# EAGLE design Planta_3 sobreamortiguada (EAGLE 7.6.0)
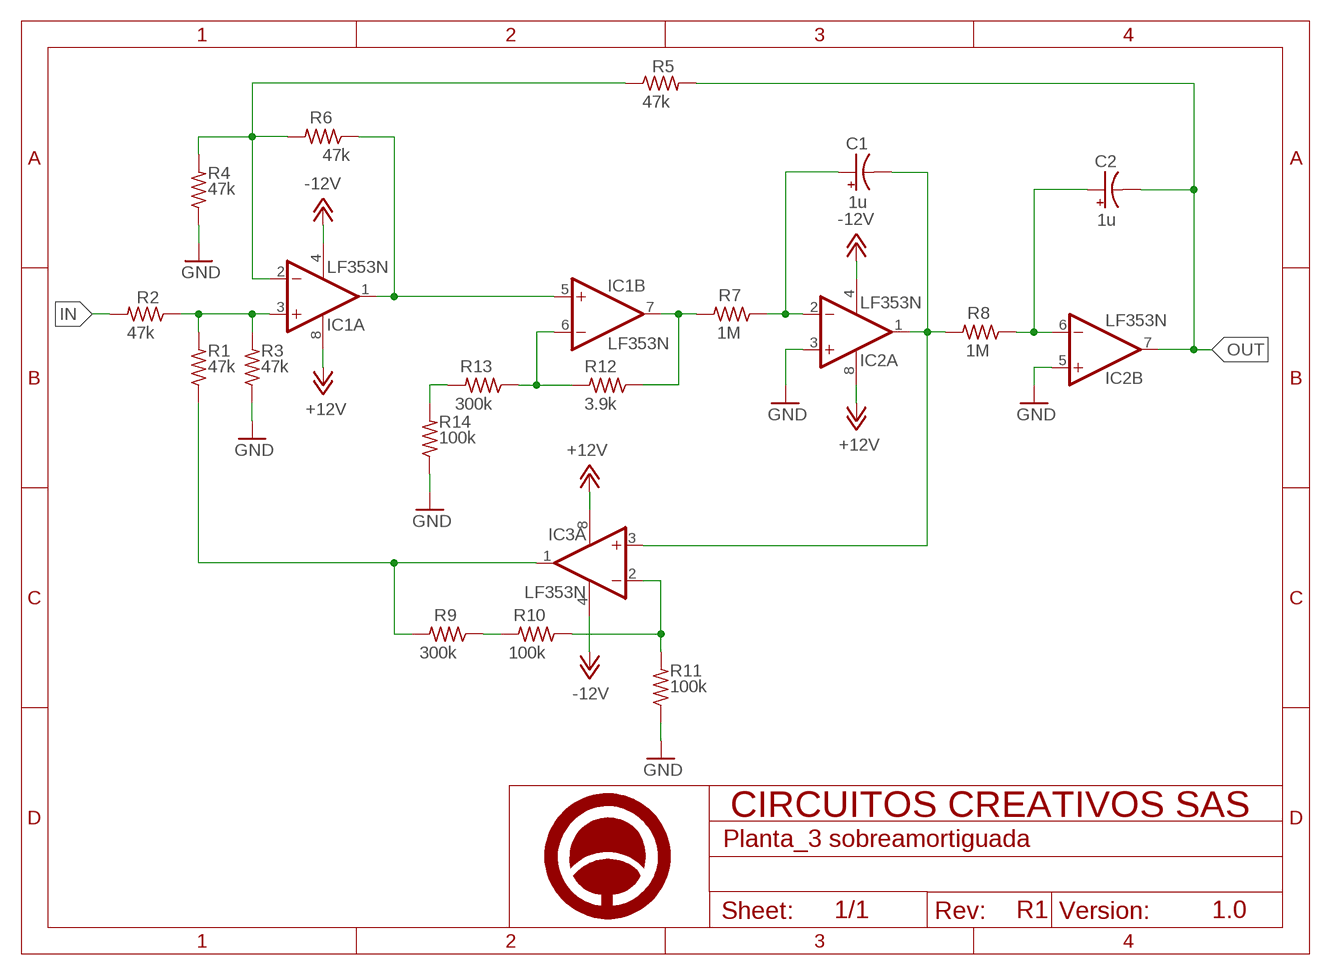
[diagram p0: schematic, sheet 1]

## Parts
C1  1u  CPOL-USE2-5  [E2-5]
C2  1u  CPOL-USE2-5  [E2-5]
F1  A5_HORIZONTAL  [LOGO]
IC1  LF353N  [DIL08]
IC2  LF353N  [DIL08]
IC3  LF353N  [DIL08]
R1  47k  R-US_0204/7  [0204/7]
R2  47k  R-US_0204/7  [0204/7]
R3  47k  R-US_0204/7  [0204/7]
R4  47k  R-US_0204/7  [0204/7]
R5  47k  R-US_0204/7  [0204/7]
R6  47k  R-US_0204/7  [0204/7]
R7  1M  R-US_0204/7  [0204/7]
R8  1M  R-US_0204/7  [0204/7]
R9  300k  R-US_0204/7  [0204/7]
R10  100k  R-US_0204/7  [0204/7]
R11  100k  R-US_0204/7  [0204/7]
R12  3.9k  R-US_0204/7  [0204/7]
R13  300k  R-US_0204/7  [0204/7]
R14  100k  R-US_0204/7  [0204/7]

## Nets
+12V: IC1.8(P:V+) IC2.8(P:V+) IC3.8(P:V+)
-12V: IC1.4(P:V-) IC2.4(P:V-) IC3.4(P:V-)
GND: IC2.3(A:+IN) IC2.5(B:+IN) R3.1 R4.1 R11.1 R14.1
IN: R2.2
N$3: IC1.2(A:-IN) R4.2 R5.1 R6.2
N$4: IC1.1(A:OUT) IC1.5(B:+IN) R6.1
N$5: C1.+ IC2.2(A:-IN) R7.1
N$6: C1.- IC2.1(A:OUT) IC3.3(A:+IN) R8.2
N$7: C2.+ IC2.6(B:-IN) R8.1
N$8: R9.1 R10.2
N$10: IC3.1(A:OUT) R1.1 R9.2
N$11: IC3.2(A:-IN) R10.1 R11.2
N$13: IC1.6(B:-IN) R12.2 R13.1
N$14: IC1.7(B:OUT) R7.2 R12.1
N$15: R13.2 R14.2
N$16: IC1.3(A:+IN) R1.2 R2.1 R3.2
OUT: C2.- IC2.7(B:OUT) R5.2
Unconnected: IC3.5(B:+IN) IC3.6(B:-IN) IC3.7(B:OUT)

## Notes on the sheet
- R1 | 1.0

## Library data of the parts
C1 C2 = rcl:CPOL-US: POLARIZED CAPACITOR, American symbol
F1 = Circuitos-Creativos-Estilos:A5_HORIZONTAL
IC1-IC3 = linear:LF353: OP AMP
R1-R14 = rcl:R-US_: RESISTOR, American symbol

## Board
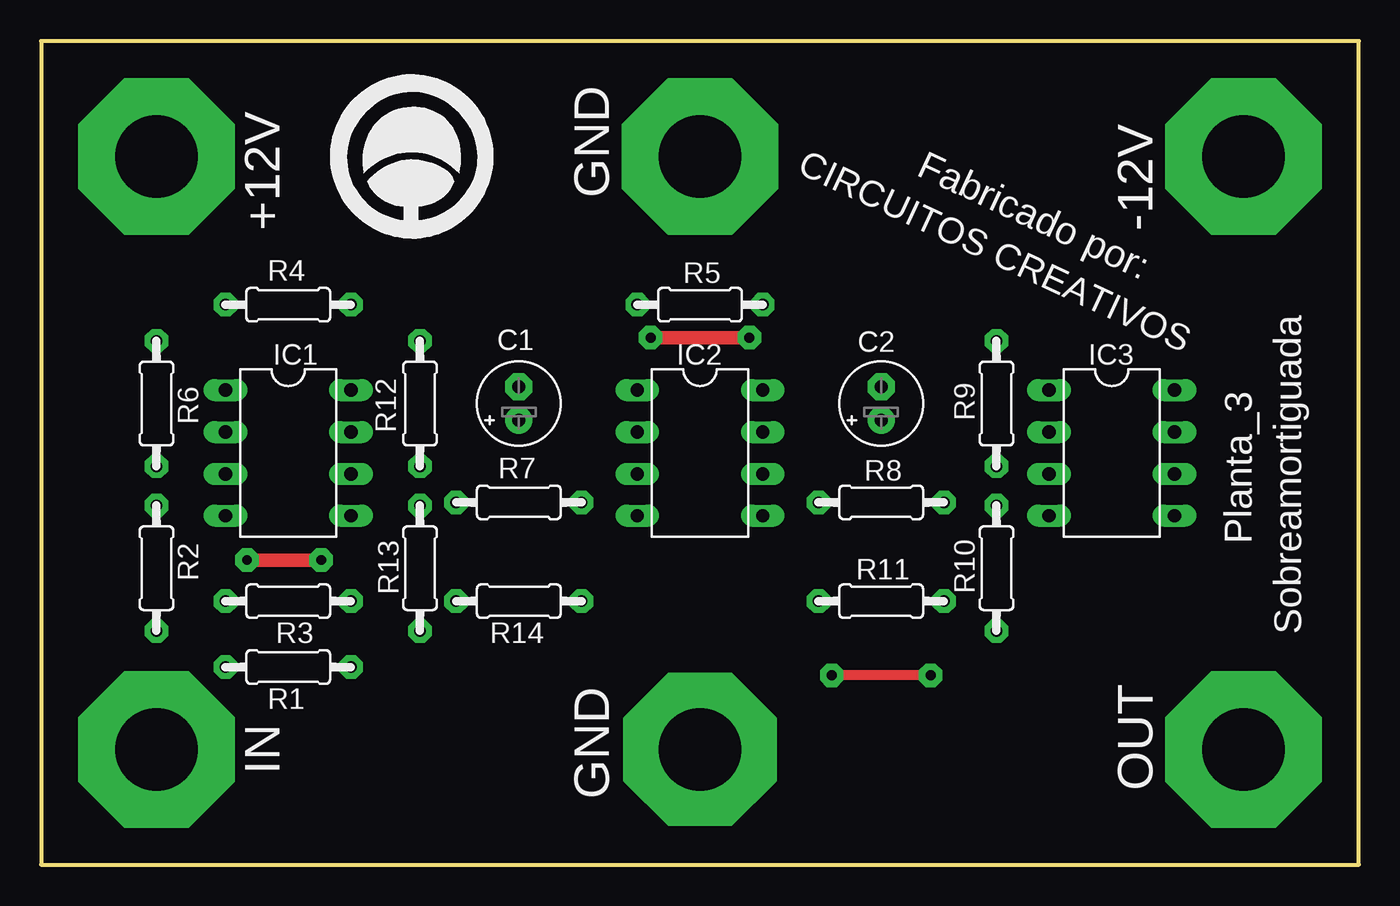
[diagram p1: board, top side]
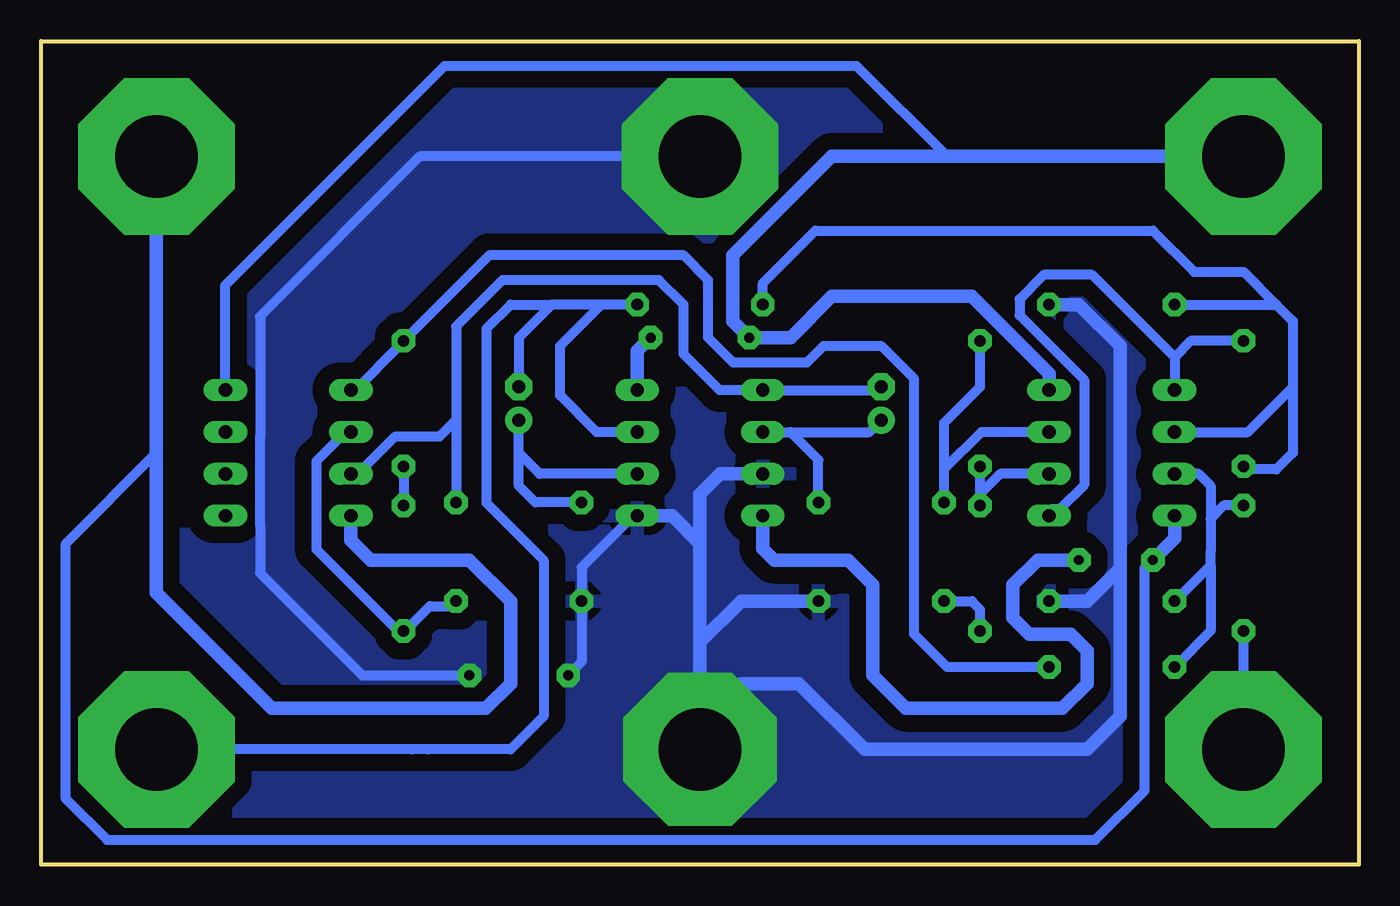
[diagram p2: board, bottom side, seen from below]

Size 80 x 50 mm. Coordinates in mm from the lower left corner, seen from the top.
Outline: 0,0 80,0 80,50 0,50 0,0
Copper layers (1*16): Top 0.035mm / dielectric 1.5mm / Bottom 0.035mm
Design rules "DRC_Serigrafia_1capa": minimum track width 0.6mm, minimum drill 0.6mm, track to track 15mil, track to pad 15mil, pad to pad 15mil, via to via 15mil, smd to smd 10mil, copper to edge 1mm, drill to drill 15mil, minimum pad ring 10mil, minimum via ring 8mil, stop-mask expansion 4mil, vias tented up to drill 0mil, thermal gap 20mil

### Footprints (pad centres in the part's own frame; a part is rotated, then mirrored left to right if it is on the bottom)
E2-5 = drill 0.8 pad 1.65: + -1.016,0 | drill 0.8 pad 1.65 octagon: - 1.016,0
DIL08 = drill 0.813 pad 1.27 long: 1 -3.81,-3.81; 2 -1.27,-3.81; 3 1.27,-3.81; 4 3.81,-3.81; 5 3.81,3.81; 6 1.27,3.81; 7 -1.27,3.81; 8 -3.81,3.81
0204/7 = drill 0.7 pad 1.422 octagon: 1 -3.81,0; 2 3.81,0

### Placement (x,y rotation side)
C1  29,28 90 top
C2  51,28 90 top
F1  22.5,43 0 top
IC1  15,25 270 top
IC2  40,25 270 top
IC3  65,25 270 top
R1  15,12 180 top
R2  7,18 270 top
R3  15,16 180 top
R4  15,34 180 top
R5  40,34 0 top
R6  7,28 270 top
R7  29,22 180 top
R8  51,22 0 top
R9  58,28 90 top
R10  58,18 90 top
R11  51,16 0 top
R12  23,28 270 top
R13  23,18 270 top
R14  29,16 180 top

### Tracks (layer width: path | path; a pad name or v marks a point on that pad's centre or on a via)
+12V  (via drill 0.6 pad 1.42, 5 pad 9.5)
  Top 0.813: v43,32 v37,32
  Bottom 0.61: IC3.8 68.81,35.19 55.5,48.5 30.5,48.5 25,43 24.5,43
  Bottom 0.813: IC1.8 18.81,29.81 23.5,34.5 32,34.5 34.5,32 v37,32 38,33 38,37 32,43 24.5,43 v7,43 | IC2.8 43.81,31.19 v43,32
-12V  (via drill 0.6 pad 1.42, 5 pad 9.5)
  Top 0.813: v17,18.5 v12.5,18.5
  Bottom 0.61: v12.5,18.5 13,18 13,4.5 16,1.5 76,1.5 78.5,4 78.5,19.5 73,25
  Bottom 0.813: IC3.4 61.19,19.69 60,18.5 54,18.5 51.5,16 51.5,11 53,9.5 66,9.5 73,16.5 73,25 v73,43 | IC2.4 36.19,19.19 35.5,18.5 31,18.5 29.5,17 29.5,11.5 27.5,9.5 18,9.5 16.5,11 16.5,13 17.5,14 20,14 21,15 21,17 19.5,18.5 v17,18.5 | v12.5,18.5 11.19,19.81 IC1.4
GND  (via drill 0.6 pad 1.42, 5 pad 9.3, 5 pad 9.5)
  Top 0.61: v54,11.5 v48,11.5
  Bottom 0.6: 47.09,18.15 44.15,21.09 IC2.5 | 66.71,20.6 66.71,26
  Bottom 0.61: v40,43 57,43 66.71,33.29 66.71,26 | 66.71,20.6 66.71,17.71 60.5,11.5 v54,11.5 | v48,11.5 47.19,12.31 R11.1 47.19,18.05 47.09,18.15
  Bottom 0.813: R14.1 37.5,16 40,13.5 | 40,13.5 40,8.5 | 40,8.5 v40,7 | IC2.3 38.77,23.73 40,22.5 40,19.5 | 40,19.5 40,13.5 | IC2.5 41.69,21.19 40,19.5 | 14.5,18 14.5,9 16.5,7 30,7 34,11 37.5,11 40,8.5 | R4.1 17,34 14.5,31.5 14.5,18 | 14.5,18 16.5,16 R3.1
  pour Bottom (isolate 1.016): -1,-1 81,-1 81,51 -1,51
IN  (via drill 5 pad 9.5)
  Bottom 0.61: v7,7 R2.2
N$3
  Bottom 0.61: R4.2 5,34 | 5,34 4,33 4,29 | 4,29 4,25 5,24 6.81,24 R6.2 | IC1.2 6.73,26.27 4,29 | R5.1 36.19,35.31 33,38.5 12.5,38.5 10,36 7,36 5,34
N$4
  Bottom 0.6: 11.19,30.81 16.19,35.81 19.13,35.81 20.6,34.34 20.6,33.35 16.68,29.43 16.68,23.05 18.15,21.58 18.64,21.58 IC1.5
  Bottom 0.61: R6.1 10.19,31.81 11.19,30.81 IC1.1
N$5
  Bottom 0.61: IC2.2 34.5,26.27 | 34.5,26.27 29.71,26.27 C1.+ | R7.1 32.81,24.58 34.5,26.27
N$6
  Bottom 0.61: C1.- 29.21,28.81 IC2.1 38.81,28.81 41,31 41,34 42.5,35.5 52,35.5 54.81,32.69 54.81,27 | 54.81,27 R8.2 | IC3.3 60.77,23.73 58.5,26 55.81,26 54.81,27
N$7
  Bottom 0.61: IC2.6 49.73,23.73 51,25 | 51,25 C2.+ | R8.1 50,22 51,23 51,25
N$8
  Bottom 0.61: R9.1 R10.2
N$10
  Bottom 0.6: IC3.1 60.82,28.94 58.37,31.39 R9.2
  Bottom 0.61: R9.2 52.81,37 41,37 39.5,35.5 39.5,32 38,30.5 33.5,30.5 32.5,31.5 29,31.5 27,29.5 27,14 25,12 R1.1
N$11
  Bottom 0.6: IC3.2 61.31,26 61.8,26 63.27,24.52 63.27,19.13 58.37,14.22 R10.1 57.88,14.22 56.41,15.7 54.94,15.7 R11.2
N$13
  Bottom 0.61: R12.2 23,22.5 | 23,22.5 R13.1 | IC1.6 21.77,23.73 23,22.5
N$14
  Bottom 0.61: R12.1 23,29 25.19,26.81 25.19,24 | 25.19,24 R7.2 | IC1.7 22.92,26.27 25.19,24
N$15
  Bottom 0.61: R14.2 23.5,16 23,15.5 R13.2
N$16
  Bottom 0.61: IC1.3 9.73,23.73 9,23 9,21 | R2.1 8.19,21.81 9,21 | 9,21 9,19 9,18.19 | 9,18.19 9,14.19 R1.2 | R3.2 9,18.19
OUT  (via drill 5 pad 9.5)
  Bottom 0.61: R5.2 46,34 | 46,34 49,34 | 49,34 51,32 C2.- | IC2.7 46.27,26.27 48.5,28.5 48.5,31.5 46,34 | 49,34 51.5,34 52.97,32.53 52.97,21.97 49.5,18.5 49.5,9 51.5,7 56.5,7 57.5,7 v73,7

### Text on the board
tPlace: GND | +12V | -12V | Fabricado por: | CIRCUITOS CREATIVOS | Planta_3 | Sobreamortiguada | IN | GND | OUT